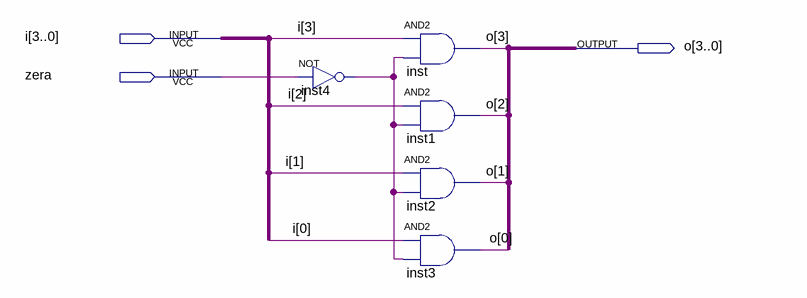
[diagram p0: schematic sheet]
// Quartus schematic zera.bdf as structural Verilog: 5 symbols, 3 pins
module zera (
  input  [3:0] i,
  input  zera,
  output [3:0] o
);

  wire inst4_out;

  not inst4 (inst4_out, zera);
  and inst (o[3], i[3], inst4_out);
  and inst1 (o[2], i[2], inst4_out);
  and inst2 (o[1], i[1], inst4_out);
  and inst3 (o[0], i[0], inst4_out);
endmodule
